# Altium schematic sheet Role_Unit.SchDoc
size A4; SheetNumber: 1; SheetTotal: 1
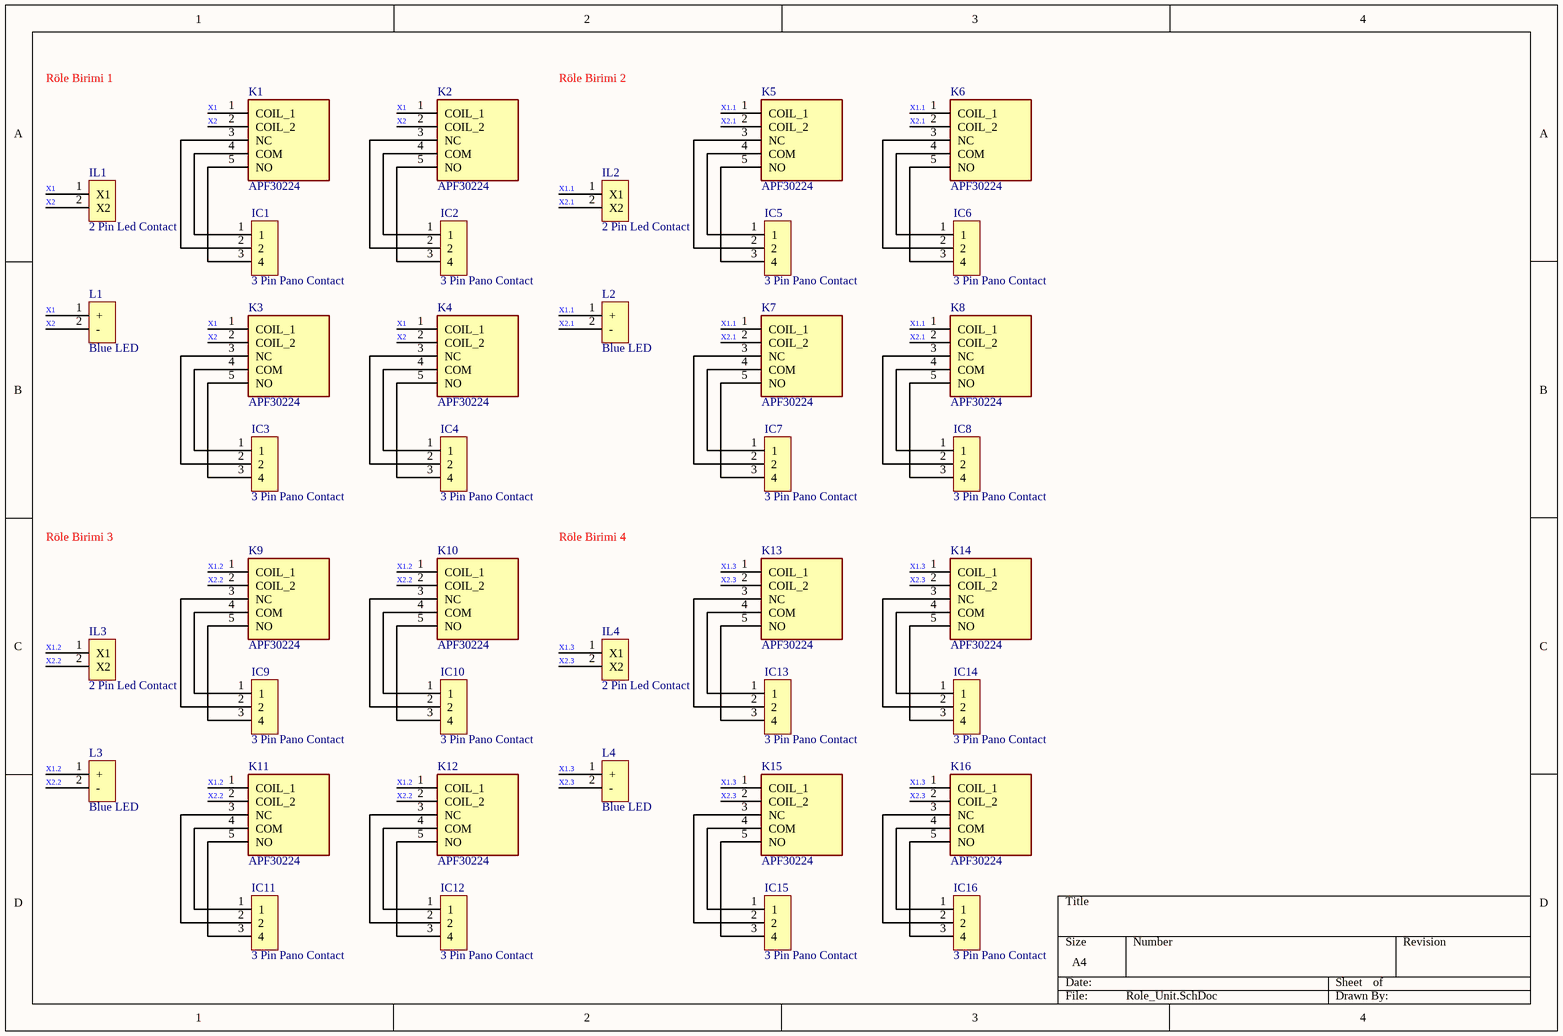
[diagram p0: Role_Unit.SchDoc]

## Parts
IC1  3 Pin Pano Contact  [Contact]
IC2  3 Pin Pano Contact  [Contact]
IC3  3 Pin Pano Contact  [Contact]
IC4  3 Pin Pano Contact  [Contact]
IC5  3 Pin Pano Contact  [Contact]
IC6  3 Pin Pano Contact  [Contact]
IC7  3 Pin Pano Contact  [Contact]
IC8  3 Pin Pano Contact  [Contact]
IC9  3 Pin Pano Contact  [Contact]
IC10  3 Pin Pano Contact  [Contact]
IC11  3 Pin Pano Contact  [Contact]
IC12  3 Pin Pano Contact  [Contact]
IC13  3 Pin Pano Contact  [Contact]
IC14  3 Pin Pano Contact  [Contact]
IC15  3 Pin Pano Contact  [Contact]
IC16  3 Pin Pano Contact  [Contact]
IL1  2 Pin Led Contact  [LED_Contact]
IL2  2 Pin Led Contact  [LED_Contact]
IL3  2 Pin Led Contact  [LED_Contact]
IL4  2 Pin Led Contact  [LED_Contact]
K1  APF30224  [APF30224]
K2  APF30224  [APF30224]
K3  APF30224  [APF30224]
K4  APF30224  [APF30224]
K5  APF30224  [APF30224]
K6  APF30224  [APF30224]
K7  APF30224  [APF30224]
K8  APF30224  [APF30224]
K9  APF30224  [APF30224]
K10  APF30224  [APF30224]
K11  APF30224  [APF30224]
K12  APF30224  [APF30224]
K13  APF30224  [APF30224]
K14  APF30224  [APF30224]
K15  APF30224  [APF30224]
K16  APF30224  [APF30224]
L1  Blue LED  [MSL_AC-DC_24V_BLUE_LED]
L2  Blue LED  [MSL_AC-DC_24V_BLUE_LED]
L3  Blue LED  [MSL_AC-DC_24V_BLUE_LED]
L4  Blue LED  [MSL_AC-DC_24V_BLUE_LED]

## Nets
X1: IL1.1(X1) K1.1(COIL_1) K2.1(COIL_1) K3.1(COIL_1) K4.1(COIL_1) L1.1(+)
X1.1: IL2.1(X1) K5.1(COIL_1) K6.1(COIL_1) K7.1(COIL_1) K8.1(COIL_1) L2.1(+)
X1.2: IL3.1(X1) K9.1(COIL_1) K10.1(COIL_1) K11.1(COIL_1) K12.1(COIL_1) L3.1(+)
X1.3: IL4.1(X1) K13.1(COIL_1) K14.1(COIL_1) K15.1(COIL_1) K16.1(COIL_1) L4.1(+)
X2: IL1.2(X2) K1.2(COIL_2) K2.2(COIL_2) K3.2(COIL_2) K4.2(COIL_2) L1.2(-)
X2.1: IL2.2(X2) K5.2(COIL_2) K6.2(COIL_2) K7.2(COIL_2) K8.2(COIL_2) L2.2(-)
X2.2: IL3.2(X2) K9.2(COIL_2) K10.2(COIL_2) K11.2(COIL_2) K12.2(COIL_2) L3.2(-)
X2.3: IL4.2(X2) K13.2(COIL_2) K14.2(COIL_2) K15.2(COIL_2) K16.2(COIL_2) L4.2(-)
NetIC1_1: IC1.1 K1.4(COM)
NetIC1_2: IC1.2 K1.3(NC)
NetIC1_3: IC1.3(4) K1.5(NO)
NetIC2_1: IC2.1 K2.4(COM)
NetIC2_2: IC2.2 K2.3(NC)
NetIC2_3: IC2.3(4) K2.5(NO)
NetIC3_1: IC3.1 K3.4(COM)
NetIC3_2: IC3.2 K3.3(NC)
NetIC3_3: IC3.3(4) K3.5(NO)
NetIC4_1: IC4.1 K4.4(COM)
NetIC4_2: IC4.2 K4.3(NC)
NetIC4_3: IC4.3(4) K4.5(NO)
NetIC5_1: IC5.1 K5.4(COM)
NetIC5_2: IC5.2 K5.3(NC)
NetIC5_3: IC5.3(4) K5.5(NO)
NetIC6_1: IC6.1 K6.4(COM)
NetIC6_2: IC6.2 K6.3(NC)
NetIC6_3: IC6.3(4) K6.5(NO)
NetIC7_1: IC7.1 K7.4(COM)
NetIC7_2: IC7.2 K7.3(NC)
NetIC7_3: IC7.3(4) K7.5(NO)
NetIC8_1: IC8.1 K8.4(COM)
NetIC8_2: IC8.2 K8.3(NC)
NetIC8_3: IC8.3(4) K8.5(NO)
NetIC9_1: IC9.1 K9.4(COM)
NetIC9_2: IC9.2 K9.3(NC)
NetIC9_3: IC9.3(4) K9.5(NO)
NetIC10_1: IC10.1 K10.4(COM)
NetIC10_2: IC10.2 K10.3(NC)
NetIC10_3: IC10.3(4) K10.5(NO)
NetIC11_1: IC11.1 K11.4(COM)
NetIC11_2: IC11.2 K11.3(NC)
NetIC11_3: IC11.3(4) K11.5(NO)
NetIC12_1: IC12.1 K12.4(COM)
NetIC12_2: IC12.2 K12.3(NC)
NetIC12_3: IC12.3(4) K12.5(NO)
NetIC13_1: IC13.1 K13.4(COM)
NetIC13_2: IC13.2 K13.3(NC)
NetIC13_3: IC13.3(4) K13.5(NO)
NetIC14_1: IC14.1 K14.4(COM)
NetIC14_2: IC14.2 K14.3(NC)
NetIC14_3: IC14.3(4) K14.5(NO)
NetIC15_1: IC15.1 K15.4(COM)
NetIC15_2: IC15.2 K15.3(NC)
NetIC15_3: IC15.3(4) K15.5(NO)
NetIC16_1: IC16.1 K16.4(COM)
NetIC16_2: IC16.2 K16.3(NC)
NetIC16_3: IC16.3(4) K16.5(NO)

## Notes on the sheet
- Röle Birimi 1
- Röle Birimi 2
- Röle Birimi 3
- Röle Birimi 4

## Library data of the parts
IC1-IC16 = Contact
IL1-IL4 = LED_Contact
K1-K16 = APF30224: Relay or Contactor; Manufacturer_Name: Panasonic; Datasheet Link: https://static6.arrow.com/aropdfconversion/564973783a483b1a25a054c599f69554fab11ee1/mech_eng_pf.pdf; Height: 15mm; Manufacturer_Part_Number: APF30224; Mouser Part Number: 769-APF30224; Mouser Price/Stock: https://www.mouser.co.uk/ProductDetail/Panasonic-Industrial-Devices/APF30224?qs=A8E0mzn7BECIUk9yoZhBGw%3D%3D; Arrow Part Number: APF30224; Arrow Price/Stock: https://www.arrow.com/en/products/apf30224/panasonic?region=nac
L1-L4 = MSL_AC-DC_24V_BLUE_LED